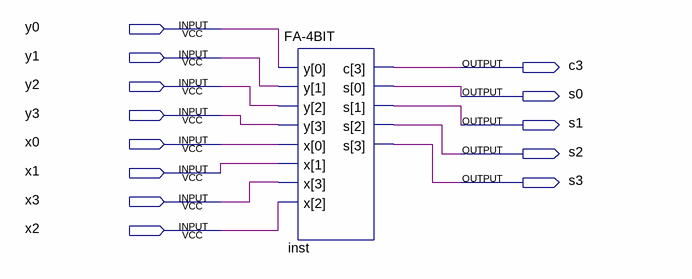
[diagram p0: schematic sheet]
// Quartus schematic FA.bdf as structural Verilog: 1 symbols, 13 pins
module FA (
  input  y0,
  input  y1,
  input  y2,
  input  y3,
  input  x0,
  input  x1,
  input  x3,
  input  x2,
  output c3,
  output s0,
  output s1,
  output s2,
  output s3
);

  \FA-4BIT  inst (.y({y3, y2, y1, y0}), .x({x3, x2, x1, x0}), .c(c3), .s({s3, s2, s1, s0}));
endmodule
